# EAGLE design base-2u-io (EAGLE 4.16)
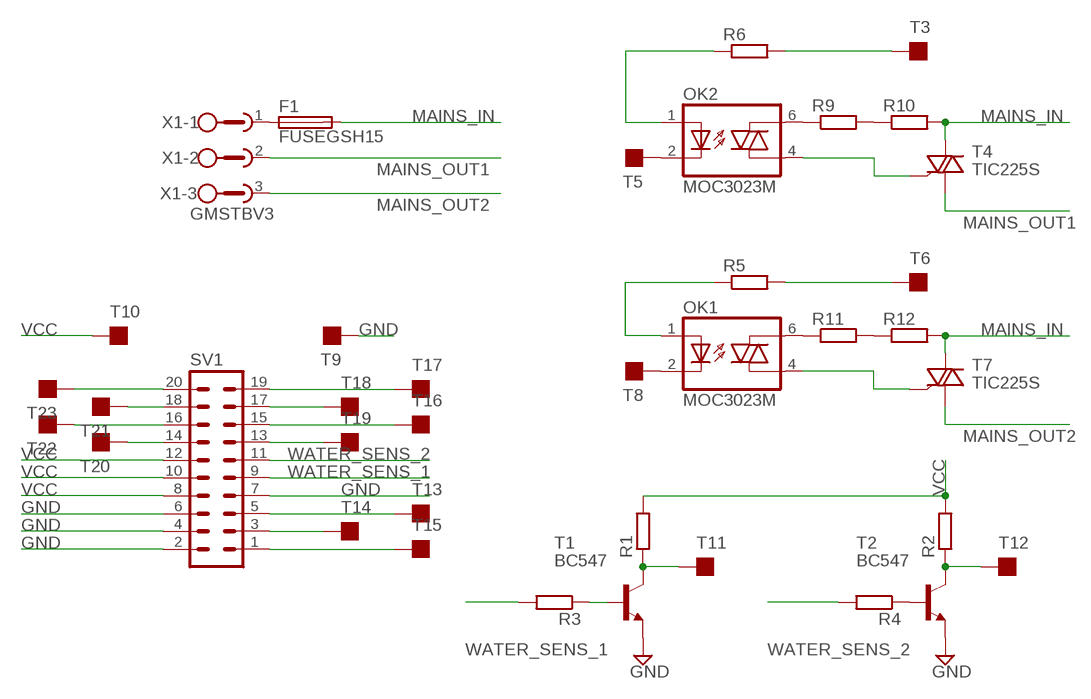
[diagram p0: schematic, sheet 1]

## Parts
F1  FUSEGSH15  [GSH15]
OK1  MOC3023M  [DIL06]
OK2  MOC3023M  [DIL06]
R1  R-EU_0207/15  [0207/15]
R2  R-EU_0207/15  [0207/15]
R3  R-EU_0207/15  [0207/15]
R4  R-EU_0207/15  [0207/15]
R5  R-EU_R0805  [R0805]
R6  R-EU_R0805  [R0805]
R9  R-EU_R1206  [R1206]
R10  R-EU_R1206  [R1206]
R11  R-EU_R1206  [R1206]
R12  R-EU_R1206  [R1206]
SV1  MA10-2W  [MA10-2W]
T1  BC547  [TO92]
T2  BC547  [TO92]
T3  TESTPOINT  [TESTPOIN]
T4  TIC225S  [TO220DS]
T5  TESTPOINT  [TESTPOIN]
T6  TESTPOINT  [TESTPOIN]
T7  TIC225S  [TO220DS]
T8  TESTPOINT  [TESTPOIN]
T9  TESTPOINT  [TESTPOIN]
T10  TESTPOINT  [TESTPOIN]
T11  TESTPOINT  [TESTPOIN]
T12  TESTPOINT  [TESTPOIN]
T13  TESTPOINT  [TESTPOIN]
T14  TESTPOINT  [TESTPOIN]
T15  TESTPOINT  [TESTPOIN]
T16  TESTPOINT  [TESTPOIN]
T17  TESTPOINT  [TESTPOIN]
T18  TESTPOINT  [TESTPOIN]
T19  TESTPOINT  [TESTPOIN]
T20  TESTPOINT  [TESTPOIN]
T21  TESTPOINT  [TESTPOIN]
T22  TESTPOINT  [TESTPOIN]
T23  TESTPOINT  [TESTPOIN]
X1  GMSTBV3  [GMSTBV3]

## Nets
GND: SV1.2 SV1.4 SV1.6 SV1.7 T1.1(E) T2.1(E) T9.1
MAINS_IN: F1.2 R10.2 R12.2 T4.A2 T7.A2
MAINS_OUT1: T4.A1 X1.2
MAINS_OUT2: T7.A1 X1.3
N$1: F1.1 X1.1
N$2: OK2.6(A2) R9.1
N$3: OK1.6(A2) R11.1
N$4: OK1.1(A) R5.1
N$5: OK2.2(C) T5.1
N$6: R5.2 T6.1
N$9: OK2.4(A1) T4.G
N$10: OK1.2(C) T8.1
N$11: OK1.4(A1) T7.G
N$12: R3.1 T1.2(B)
N$13: R4.1 T2.2(B)
N$14: R1.1 T1.3(C) T11.1
N$15: R2.1 T2.3(C) T12.1
N$16: R9.2 R10.1
N$17: R11.2 R12.1
N$20: SV1.1 T15.1
N$21: SV1.3 T14.1
N$22: SV1.5 T13.1
N$23: R6.2 T3.1
N$24: OK2.1(A) R6.1
N$88: SV1.20 T23.1
N$89: SV1.18 T21.1
N$90: SV1.16 T22.1
N$91: SV1.14 T20.1
N$92: SV1.13 T19.1
N$93: SV1.15 T16.1
N$94: SV1.17 T18.1
N$95: SV1.19 T17.1
VCC: R1.2 R2.2 SV1.8 SV1.10 SV1.12 T10.1
WATER_SENS_1: R3.2 SV1.9
WATER_SENS_2: R4.2 SV1.11

## Library data of the parts
F1 = fuse:FUSE: Fuse
OK1 OK2 = optocoupler:MOC30*M: RANDOM-PHASE OPTOISOLATORS TRIAC DRIVER OUTPUT Source: http://www.fairchildsemi.com MOC3020-M.pdf
R1-R6 R9-R12 = rcl:R-EU_: RESISTOR, European symbol
SV1 = con-lstb:MA10-2W: PIN HEADER
T1 T2 = transistor:BC547: NPN TRANSISTOR
T3 T5 T6 T8-T23 = ads4:TESTPOINT: Test point
T4 T7 = triac:TIC225S: TRIAC
X1 = con-phoenix-508:GMSTBV3: PHOENIX

## Board
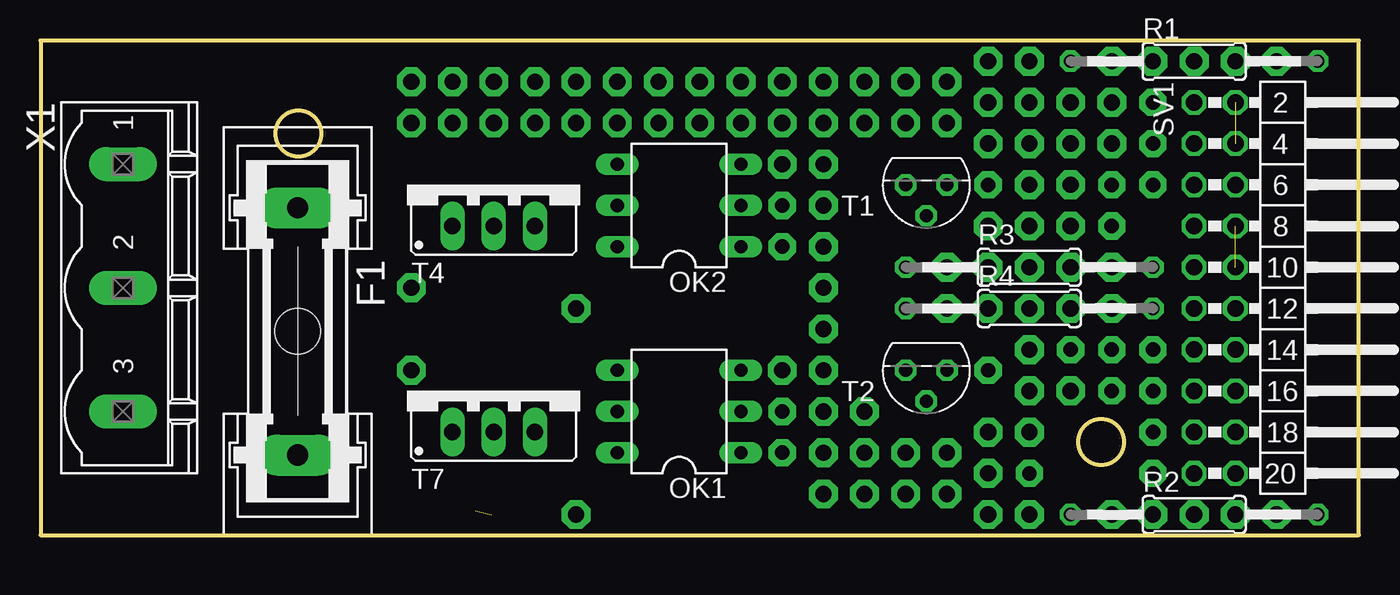
[diagram p1: board, top side]
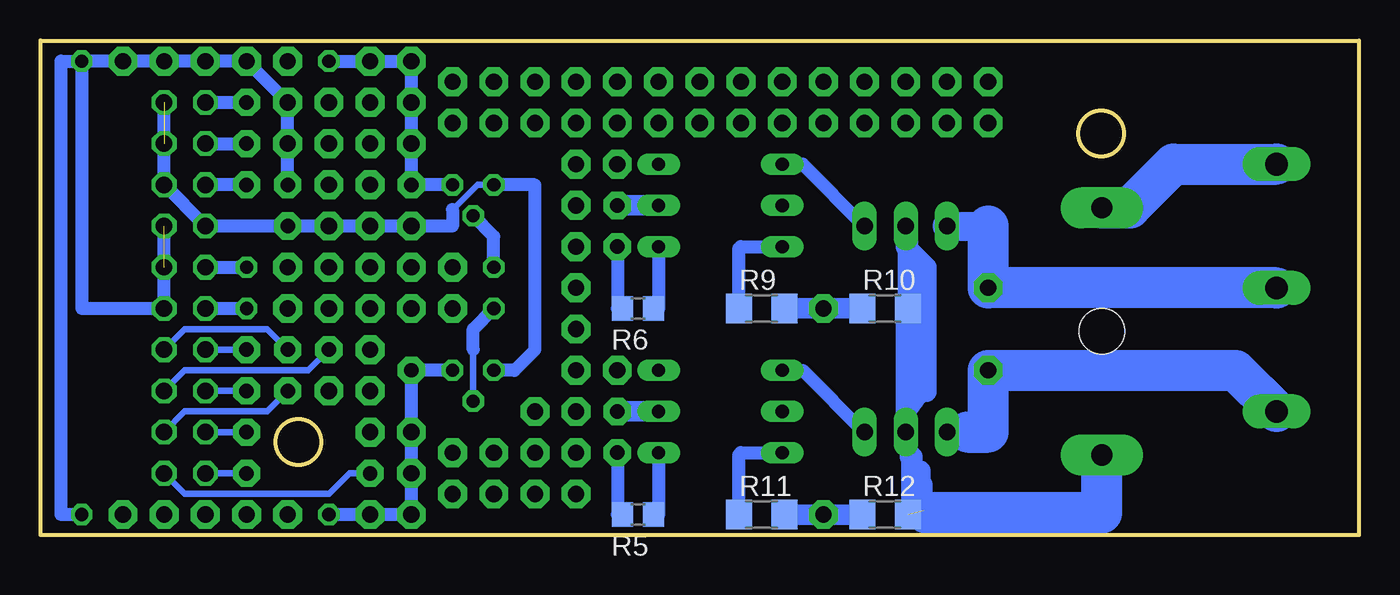
[diagram p2: board, bottom side, seen from below]

Size 81.28 x 30.48 mm. Coordinates in mm from the lower left corner, seen from the top.
Outline: 81.28,30.48 0,30.48 0,0 81.28,0 81.28,30.48
Outline: circle at 15.89,24.74 radius 1.4
Outline: circle at 65.39,5.74 radius 1.4
Copper layers (1*16): Top 0.035mm / dielectric 1.5mm / Bottom 0.035mm
Design rules "default": minimum track width 10mil, minimum drill 24mil, track to track 8mil, track to pad 8mil, pad to pad 8mil, via to via 8mil, smd to smd 8mil, copper to edge 40mil, drill to drill 8mil, minimum pad ring 10mil, minimum via ring 8mil, stop-mask expansion 4mil, vias tented up to drill 0mil, thermal gap 10mil

### Footprints (pad centres in the part's own frame; a part is rotated, then mirrored left to right if it is on the bottom)
GSH15 = drill 1.321 pad 2.54 long: 1 -7.62,0; 2 7.62,0 | hole 2.794: 0,0
DIL06 = drill 0.813 long: 1 -2.54,-3.81; 2 0,-3.81; 3 2.54,-3.81; 4 2.54,3.81; 5 0,3.81; 6 -2.54,3.81
0207/15 = drill 0.813 octagon: 1 -7.62,0; 2 7.62,0
R0805 = smd 1.3 x 1.5: 1 -0.95,0; 2 0.95,0
R1206 = smd 1.6 x 1.8: 1 -1.4,0; 2 1.4,0
MA10-2W = drill 1.016 octagon: 1 -11.43,-1.27; 2 -11.43,1.27; 3 -8.89,-1.27; 4 -8.89,1.27; 5 -6.35,-1.27; 6 -6.35,1.27; 7 -3.81,-1.27; 8 -3.81,1.27; 9 -1.27,-1.27; 10 -1.27,1.27; 11 1.27,-1.27; 12 1.27,1.27; 13 3.81,-1.27; 14 3.81,1.27; 15 6.35,-1.27; 16 6.35,1.27; 17 8.89,-1.27; 18 8.89,1.27; 19 11.43,-1.27; 20 11.43,1.27
TO92 = drill 0.813 octagon: 1 1.27,0; 2 0,1.905; 3 -1.27,0
TESTPOIN = drill 0.889 pad 1.676 octagon: 1 0,0
TO220DS = drill 1.016 long: A1 -2.54,-2.54; A2 0,-2.54; G 2.54,-2.54
GMSTBV3 = drill 1.397 long: 1 -7.62,0; 2 0,0; 3 7.62,0

### Placement (x,y rotation side)
F1  15.85,12.55 270 top
OK1  39.37,7.62 90 top
OK2  39.37,20.32 90 top
R1  71.12,29.21 0 top
R2  71.12,1.27 0 top
R3  60.96,16.51 0 top
R4  60.96,13.97 0 top
R5  44.45,1.27 180 bottom
R6  44.45,13.97 180 bottom
R9  36.83,13.97 0 bottom
R10  29.21,13.97 0 bottom
R11  36.83,1.27 0 bottom
R12  29.21,1.27 0 bottom
SV1  72.39,15.24 270 top
T1  54.61,21.59 180 top
T2  54.61,10.16 180 top
T3  45.72,17.78 0 top
T4  27.94,21.59 0 top
T5  45.72,20.32 0 top
T6  45.72,5.08 0 top
T7  27.94,8.89 0 top
T8  45.72,7.62 0 top
T9  66.04,19.05 0 top
T10  66.04,21.59 0 top
T11  58.42,21.59 0 top
T12  58.42,10.16 90 top
T13  68.58,21.59 0 top
T14  68.58,24.13 0 top
T15  68.58,26.67 0 top
T16  68.58,8.89 0 top
T17  68.58,3.81 0 top
T18  68.58,6.35 0 top
T19  68.58,11.43 0 top
T20  66.04,11.43 0 top
T21  66.04,8.89 0 top
T22  63.5,11.43 0 top
T23  60.96,3.81 0 top
X1  5.08,15.24 270 top

### Tracks (layer width: path | path; a pad name or v marks a point on that pad's centre or on a via)
GND  (via drill 1 pad 1.78)  (1 unrouted)
  Bottom 0.406: T1.1 54.35,21.59 55.88,20.05
  Bottom 0.813: SV1.2 SV1.6 SV1.7 T9.1 v63.5,19.05 v60.96,19.05 v58.42,19.05 55.88,19.05 55.88,20.05 | T2.1 52.07,10.16 50.8,11.43 50.8,21.59 T1.1
MAINS_IN  (1 unrouted)
  Bottom 0.813: R12.2 27.81,6.22 T7.A2
  Bottom 1.27: T7.A2 27.94,7.62 | 27.94,7.62 27.94,13.97 R10.2 27.81,18.92 T4.A2 | 27.94,7.62 27.08,8.84 26.67,8.84 26.67,16.51 27.94,17.78
  Bottom 2.54: F1.2 15.85,1.38 15.86,1.36 26.7,1.36 26.82,1.5
MAINS_OUT1
  Bottom 1.778: T4.A1 22.86,19.05
  Bottom 2.54: 22.86,19.05 22.86,15.24 X1.2
MAINS_OUT2
  Bottom 1.27: T7.A1 24.13,6.35
  Bottom 2.54: 24.13,6.35 22.86,6.35 22.86,10.16 7.62,10.16 X1.3
N$1
  Bottom 2.54: F1.1 14.12,20.18 11.43,22.86 X1.1
N$2
  Bottom 0.813: R9.1 38.23,17.65 38.1,17.78 OK2.6
N$3
  Bottom 0.813: R11.1 38.23,4.95 38.1,5.08 OK1.6
N$4
  Bottom 0.813: R5.1 43.18,1.27 OK1.1
N$5
  Bottom 1.27: T5.1 OK2.2
N$6
  Bottom 0.813: R5.2 45.72,1.27 T6.1
N$7  (via drill 1 pad 1.78)
  other vias: 33.02,1.27
N$8  (via drill 1 pad 1.78)
  other vias: 33.02,13.97
N$9
  Bottom 0.813: OK2.4 34.29,22.86 T4.G
N$10
  Bottom 1.27: T8.1 OK1.2
N$11
  Bottom 0.813: OK1.4 34.29,10.16 T7.G
N$12
  Bottom 0.813: T1.2 54.62,19.68 53.34,18.39 R3.1
N$13
  Bottom 0.406: T2.2 54.61,11.43
  Bottom 0.813: 54.61,11.43 54.61,12.7 R4.1
N$14  (via drill 1 pad 1.78)
  Bottom 0.813: T1.3 T11.1 v58.42,24.13 v58.42,26.67 v58.42,29.21 v60.96,29.21 R1.1
N$15  (via drill 1 pad 1.78)
  Bottom 0.813: T2.3 T12.1 v58.42,6.35 v58.42,3.81 v58.42,1.27 v60.96,1.27 R2.1
N$16
  Bottom 1.27: 30.48,13.97 R10.1 R9.2
N$17
  Bottom 1.27: 30.48,1.27 R12.1 R11.2
N$18  (via drill 1 pad 1.78)
  other vias: 22.86,10.16
N$19  (via drill 1 pad 1.78)
  other vias: 22.86,15.24
N$20
  Bottom 0.813: SV1.1 T15.1
N$21
  Bottom 0.813: SV1.3 T14.1
N$22
  Bottom 0.813: T13.1 SV1.5
N$23
  Bottom 0.813: R6.2 45.72,13.97 T3.1
N$24
  Bottom 0.813: R6.1 43.18,13.97 OK2.1
N$25  (via drill 1 pad 1.78)
  other vias: 63.5,21.59
N$26  (via drill 1 pad 1.78)
  other vias: 63.5,24.13
N$27  (via drill 1 pad 1.78)
  other vias: 63.5,26.67
N$28  (via drill 1 pad 1.78)
  other vias: 60.96,26.67
N$29  (via drill 1 pad 1.78)
  other vias: 60.96,24.13
N$30  (via drill 1 pad 1.78)
  other vias: 60.96,21.59
N$31  (via drill 1 pad 1.78)
  other vias: 43.18,25.4
N$32  (via drill 1 pad 1.78)
  other vias: 43.18,27.94
N$33  (via drill 1 pad 1.78)
  other vias: 45.72,27.94
N$34  (via drill 1 pad 1.78)
  other vias: 45.72,25.4
N$35  (via drill 1 pad 1.78)
  other vias: 48.26,27.94
N$36  (via drill 1 pad 1.78)
  other vias: 48.26,25.4
N$37  (via drill 1 pad 1.78)
  other vias: 50.8,27.94
N$38  (via drill 1 pad 1.78)
  other vias: 50.8,25.4
N$39  (via drill 1 pad 1.78)
  other vias: 53.34,27.94
N$40  (via drill 1 pad 1.78)
  other vias: 53.34,25.4
N$41  (via drill 1 pad 1.78)
  other vias: 55.88,27.94
N$42  (via drill 1 pad 1.78)
  other vias: 55.88,25.4
N$43  (via drill 1 pad 1.78)
  other vias: 45.72,22.86
N$44  (via drill 1 pad 1.78)
  other vias: 48.26,22.86
N$45  (via drill 1 pad 1.78)
  other vias: 48.26,20.32
N$46  (via drill 1 pad 1.78)
  other vias: 48.26,17.78
N$47  (via drill 1 pad 1.78)
  other vias: 48.26,15.24
N$48  (via drill 1 pad 1.78)
  other vias: 48.26,12.7
N$49  (via drill 1 pad 1.78)
  other vias: 48.26,10.16
N$50  (via drill 1 pad 1.78)
  other vias: 45.72,10.16
N$51  (via drill 1 pad 1.78)
  other vias: 48.26,7.62
N$52  (via drill 1 pad 1.78)
  other vias: 48.26,5.08
N$53  (via drill 1 pad 1.78)
  other vias: 48.26,2.54
N$54  (via drill 1 pad 1.78)
  other vias: 50.8,7.62
N$55  (via drill 1 pad 1.78)
  other vias: 50.8,5.08
N$56  (via drill 1 pad 1.78)
  other vias: 50.8,2.54
N$57  (via drill 1 pad 1.78)
  other vias: 53.34,2.54
N$58  (via drill 1 pad 1.78)
  other vias: 53.34,5.08
N$59  (via drill 1 pad 1.78)
  other vias: 55.88,5.08
N$60  (via drill 1 pad 1.78)
  other vias: 55.88,2.54
N$61  (via drill 1 pad 1.78)
  other vias: 40.64,25.4
N$62  (via drill 1 pad 1.78)
  other vias: 40.64,27.94
N$63  (via drill 1 pad 1.78)
  other vias: 38.1,25.4
N$64  (via drill 1 pad 1.78)
  other vias: 38.1,27.94
N$65  (via drill 1 pad 1.78)
  other vias: 35.56,27.94
N$66  (via drill 1 pad 1.78)
  other vias: 35.56,25.4
N$67  (via drill 1 pad 1.78)
  other vias: 33.02,25.4
N$68  (via drill 1 pad 1.78)
  other vias: 33.02,27.94
N$69  (via drill 1 pad 1.78)
  other vias: 30.48,27.94
N$70  (via drill 1 pad 1.78)
  other vias: 30.48,25.4
N$71  (via drill 1 pad 1.78)
  other vias: 27.94,25.4
N$72  (via drill 1 pad 1.78)
  other vias: 27.94,27.94
N$73  (via drill 1 pad 1.78)
  other vias: 25.4,27.94
N$74  (via drill 1 pad 1.78)
  other vias: 25.4,25.4
N$75  (via drill 1 pad 1.78)
  other vias: 22.86,25.4
N$76  (via drill 1 pad 1.78)
  other vias: 22.86,27.94
N$77  (via drill 1 pad 1.78)
  other vias: 66.04,29.21
N$78  (via drill 1 pad 1.78)
  other vias: 66.04,16.51
N$79  (via drill 1 pad 1.78)
  other vias: 66.04,13.97
N$80  (via drill 1 pad 1.78)
  other vias: 63.5,13.97
N$81  (via drill 1 pad 1.78)
  other vias: 63.5,16.51
N$82  (via drill 1 pad 1.78)
  other vias: 60.96,16.51
N$83  (via drill 1 pad 1.78)
  other vias: 60.96,13.97
N$84  (via drill 1 pad 1.78)
  other vias: 58.42,13.97
N$85  (via drill 1 pad 1.78)
  other vias: 58.42,16.51
N$86  (via drill 1 pad 1.78)
  other vias: 55.88,16.51
N$87  (via drill 1 pad 1.78)
  other vias: 55.88,13.97
N$88
  Bottom 0.406: T23.1 62.23,3.81 63.5,2.54 72.39,2.54 SV1.20
N$89
  Bottom 0.406: SV1.18 72.39,7.62 67.31,7.62 T21.1
N$90
  Bottom 0.406: SV1.16 72.39,10.16 64.77,10.16 T22.1
N$91
  Bottom 0.406: SV1.14 72.39,12.7 67.31,12.7 T20.1
N$92
  Bottom 0.406: SV1.13 T19.1
N$93
  Bottom 0.406: SV1.15 T16.1
N$94
  Bottom 0.406: SV1.17 T18.1
N$95
  Bottom 0.406: SV1.19 T17.1
N$96  (via drill 1 pad 1.78)
  other vias: 60.96,11.43
N$97  (via drill 1 pad 1.78)
  other vias: 60.96,8.89
N$98  (via drill 1 pad 1.78)
  other vias: 60.96,6.35
N$99  (via drill 1 pad 1.78)
  other vias: 63.5,8.89
N$100  (via drill 1 pad 1.78)
  other vias: 76.2,1.27
N$101  (via drill 1 pad 1.78)
  other vias: 73.66,1.27
N$102  (via drill 1 pad 1.78)
  other vias: 71.12,1.27
N$103  (via drill 1 pad 1.78)
  other vias: 68.58,1.27
N$104  (via drill 1 pad 1.78)
  other vias: 66.04,1.27
N$105
  Bottom 1.27: 26.91,2.44 26.91,3.1 27.04,3.1 27.04,3.97 27.52,3.97 27.52,4.84 27.68,4.84
VCC  (via drill 1 pad 1.78)  (1 unrouted)
  Bottom 0.813: R1.2 80.01,29.21 80.01,1.27 R2.2 | R1.2 78.74,13.97 SV1.12 SV1.8 | T10.1 v66.04,24.13 v66.04,26.67 v68.58,29.21 v71.12,29.21 v73.66,29.21 v76.2,29.21 R1.2
WATER_SENS_1
  Bottom 0.813: SV1.9 R3.2
WATER_SENS_2
  Bottom 0.813: SV1.11 R4.2

### Text on the board
Measures: 24.74 | 15.24 | 5.74 | 15.89 | 40.64 | 65.39